# EAGLE design WMF Ambient SmartPot_B (EAGLE 9.5.1)
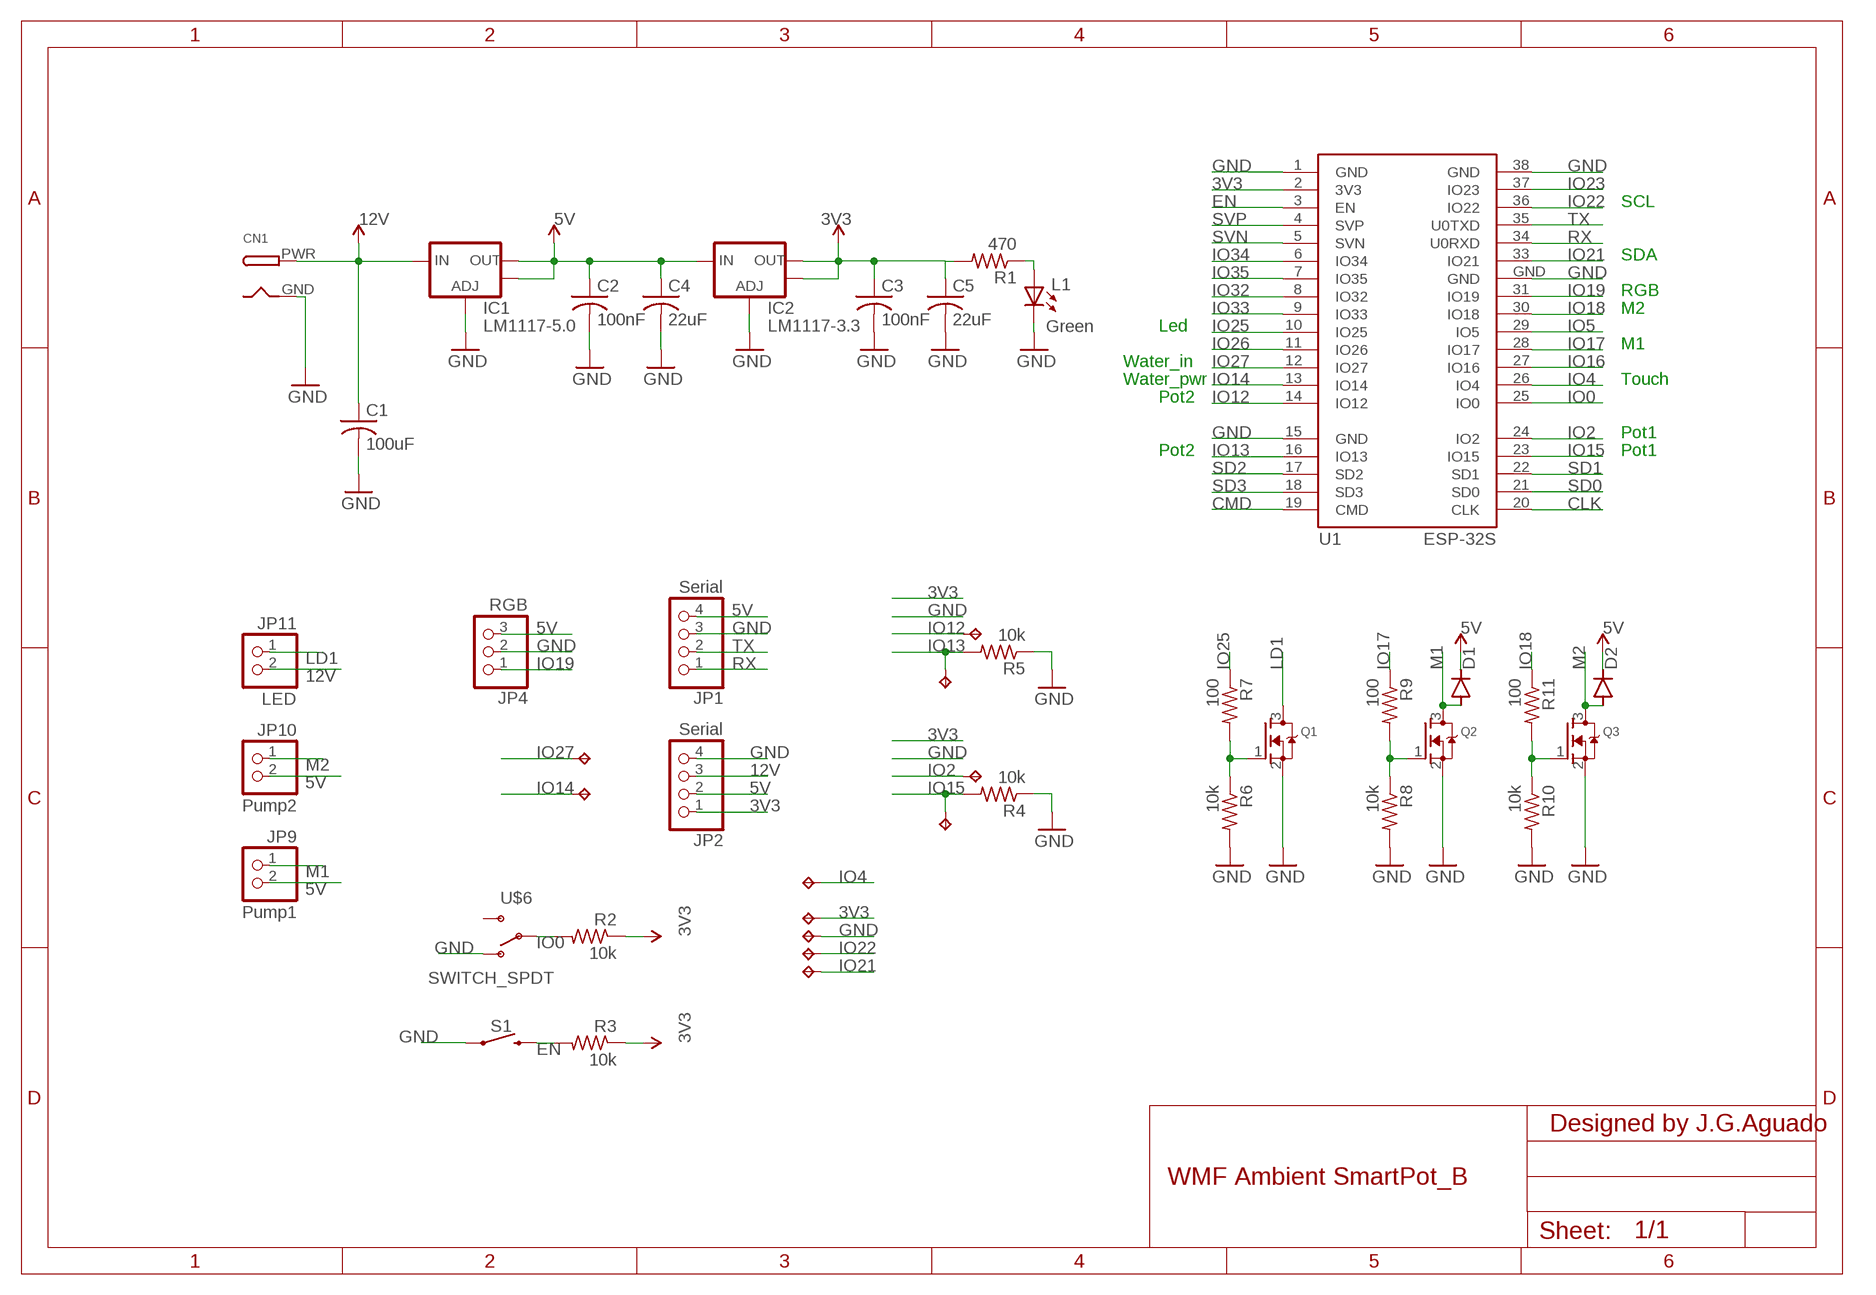
[diagram p0: schematic, sheet 1]

## Parts
C1  100uF  C1206  [1206]
C2  100nF  C1206  [1206]
C3  100nF  C1206  [1206]
C4  22uF  C1206  [1206]
C5  22uF  C1206  [1206]
CN1  DCBARREL-2  [DCJACK_2MM_PTH-2]
D1  CGRM4002-G  [SOD-123_MINI-SMA]
D2  CGRM4002-G  [SOD-123_MINI-SMA]
IC1  LM1117-5.0  V_REG_LM1117SOT223  [SOT223]
IC2  LM1117-3.3  V_REG_LM1117SOT223  [SOT223]
JP1  Serial  PINHD-1X4  [1X04]
JP2  Serial  PINHD-1X4  [1X04]
JP4  RGB  PINHD-1X3  [1X03]
JP9  Pump1  PINHD-1X2  [1X02]
JP10  Pump2  PINHD-1X2  [1X02]
JP11  LED  PINHD-1X2  [1X02]
L1  Green  LED1206  [LED1206]
Q1  MOSFET-NREFLOW  [SOT23]
Q2  MOSFET-NREFLOW  [SOT23]
Q3  MOSFET-NREFLOW  [SOT23]
R1  470  R1206  [1206]
R2  10k  R1206  [1206]
R3  10k  R1206  [1206]
R4  10k  R1206  [1206]
R5  10k  R1206  [1206]
R6  10k  R1206  [1206]
R7  100  R1206  [1206]
R8  10k  R1206  [1206]
R9  100  R1206  [1206]
R10  10k  R1206  [1206]
R11  100  R1206  [1206]
S1  MOMENTARY-SWITCH-SPST-SMD-6.0X3.5MM  [TACTILE_SWITCH_SMD_6.0X3.5MM]
TP2  TPTP15SQ  [TP15SQ]
TP3  TPTP15SQ  [TP15SQ]
TP4  TPTP15SQ  [TP15SQ]
TP5  TPTP15SQ  [TP15SQ]
TP10  TPTP15SQ  [TP15SQ]
TP11  TPTP15SQ  [TP15SQ]
TP13  TPTP15SQ  [TP15SQ]
TP14  TPTP15SQ  [TP15SQ]
TP15  TPTP15SQ  [TP15SQ]
TP18  TPTP15SQ  [TP15SQ]
TP19  TPTP15SQ  [TP15SQ]
U1  ESP-32S  [ESP-32S]
U$6  SWITCH_SPDT  [KPS-1290]

## Nets
3V3: C3.1 C5.1 IC2.2(OUT) IC2.4(OUT) JP2.1 R1.2 R2.1 R3.1 TP2.TP U1.2(3V3) ; supply symbol labelled VCC
5V: C2.1 C4.1 D1.C D2.C IC1.2(OUT) IC1.4(OUT) IC2.3(IN) JP1.4 JP2.2 JP4.3 JP9.2 JP10.2 ; supply symbol labelled VCC
12V: C1.1 CN1.PWR IC1.3(IN) JP2.3 JP11.2 ; supply symbol labelled VCC
CLK: U1.20(CLK)
CMD: U1.19(CMD)
EN: R3.2 S1.2 U1.3(EN)
GND: C1.2 C2.2 C3.2 C4.2 C5.2 CN1.GND IC1.1(ADJ) IC2.1(ADJ) JP1.3 JP2.4 JP4.2 L1.C Q1.2(S) Q2.2(S) Q3.2(S) R4.1 R5.1 R6.2 R8.2 R10.2 S1.1 TP3.TP U1.1(GND) U1.15(GND) U1.38(GND) U1.GND U$6.O
IO0: R2.2 U1.25(IO0) U$6.P
IO2: TP15.TP U1.24(IO2)
IO4: TP10.TP U1.26(IO4)
IO5: U1.29(IO5)
IO12: TP14.TP U1.14(IO12)
IO13: R5.2 TP18.TP U1.16(IO13)
IO14: TP13.TP U1.13(IO14)
IO15: R4.2 TP19.TP U1.23(IO15)
IO16: U1.27(IO16)
IO17: R9.1 U1.28(IO17)
IO18: R11.1 U1.30(IO18)
IO19: JP4.1 U1.31(IO19)
IO21: TP5.TP U1.33(IO21)
IO22: TP4.TP U1.36(IO22)
IO23: U1.37(IO23)
IO25: R7.1 U1.10(IO25)
IO26: U1.11(IO26)
IO27: TP11.TP U1.12(IO27)
IO32: U1.8(IO32)
IO33: U1.9(IO33)
IO34: U1.6(IO34)
IO35: U1.7(IO35)
LD1: JP11.1 Q1.3(D)
M1: D1.A JP9.1 Q2.3(D)
M2: D2.A JP10.1 Q3.3(D)
N$1: L1.A R1.1
N$6: Q1.1(G) R6.1 R7.2
N$7: Q2.1(G) R8.1 R9.2
N$8: Q3.1(G) R10.1 R11.2
RX: JP1.1 U1.34(U0RXD)
SD0: U1.21(SD0)
SD1: U1.22(SD1)
SD2: U1.17(SD2)
SD3: U1.18(SD3)
SVN: U1.5(SVN)
SVP: U1.4(SVP)
TX: JP1.2 U1.35(U0TXD)
Unconnected: U$6.S

## Notes on the sheet
- SCL
- SDA
- RGB
- M2
- Led
- M1
- Water_in
- Water_pwr | Touch
- Pot2
- Pot1
- Pot2 | Pot1
- Designed by J.G.Aguado

## Library data of the parts
C1-C5 = SpaceDIY_passive_components:C1206
CN1 = SpaceDIY_connectors:DCBARREL-2: 2.0mm DC Barrel Jack DCJACK_2MM_PTH - Through Hole Jack (4UConnector: 05537)
D1 D2 = diode:CGRM400*-G: Molded plasitc,JEDEC SOD-123/Mini SMA Source: Comchip CGRM4001-G.pdf
IC1 IC2 = SparkFun:V_REG_LM1117: Voltage Regulator LM1117 Standard adjustable voltage regulator but in SMD form. Spark Fun Electronics SKU : COM-00595
JP1 JP2 = SpaceDIY_connectors:PINHD-1X4: PIN HEADER
JP4 = SpaceDIY_connectors:PINHD-1X3: PIN HEADER
JP9-JP11 = SpaceDIY_connectors:PINHD-1X2: PIN HEADER
L1 = SpaceDIY_passive_components:LED1206
Q1-Q3 = adafruit:MOSFET-N: N-Channel Mosfet 2N7002E - 60V 260mA SOT23 [Digikey: 2N7002ET1GOSTR-ND] - REEL BSH103 - 30V 850mA SOT23 [Digikey: 568-5013-1-ND]
R1-R11 = SpaceDIY_passive_components:R1206
S1 = SparkFun-Switches:MOMENTARY-SWITCH-SPST: Momentary Switch (Pushbutton) - SPST Normally-open (NO) SPST momentary switches (buttons, pushbuttons). Variants PTH-12MM - 12mm square, through-hole Momentary Pushbutton Switch - 12mm Square <https://www.sparkfun.com/products/9190> (COM-09190) PTH-6.0MM, PTH-6.0MM-KIT - 6.0mm square, through-hole Mini Pushbutton Switch <https://www.sparkfun.com/products/97> (COM-00097) KIT package intended for soldering kit's - only one side of pads' copper is exposed. PTH-RIGHT-ANGLE-KIT - Right-angle, through-hole Right Angle Tactile Button <https://www.sparkfun.com/products/10791> - Used on SparkFun BigTime Watch Kit <https://www.sparkfun.com/products/11734> SMD-12MM - 12mm square, surface-mount Tactile Button - SMD (12mm) <https://www.sparkfun.com/products/12993> (COM-12993) Used on SparkFun PicoBoard <https://www.sparkfun.com/products/11888> SMD-4.5MM - 4.5mm Square Trackball Switch Used on SparkFun Blackberry Trackballer Breakout <https://www.sparkfun.com/products/13169> SMD-4.6MMX2.8MM - 4.60mm x 2.80mm, surface mount Used on SparkFun SAMD21 Mini Breakout <https://www.sparkfun.com/products/13664> SMD-5.2MM, SMD-5.2-REDUNDANT - 5.2mm square, surface-mount Mini Pushbutton Switch - SMD <https://www.sparkfun.com/products/8720> (COM-08720) Used on Arduino Pro Mini <https://www.sparkfun.com/products/11114> REDUNDANT package connects both switch circuits together SMD-6.0X3.5MM - 6.0 x 3.5mm, surface mount Momentary Reset Switch SMD <https://www.sparkfun.com/products/8229> (COM-08229) SMD-6.2MM-TALL - 6.2mm square, surface mount Tactile Button - SMD (6mm) <https://www.sparkfun.com/products/12992> Used on SparkFun Digital Sandbox <https://www.sparkfun.com/products/12651> SMD-RIGHT-ANGLE - Right-angle, surface mount Used on SparkFun Block for Intel® Edison - Arduino <https://www.sparkfun.com/products/13036>; PROD_ID: SWCH-00815; SF_SKU: COM-08229
TP2-TP5 TP10 TP11 TP13-TP15 TP18 TP19 = testpad:TP: Test pad
U1 = esp32:ESP-32S: Ai-Thinker ESP-32S
U$6 = SparkFun-Retired:SWITCH_SPDT: SWCH-10651 Side-actuated SPDT slide switch, as used on the Arduino Pro; PROD_ID: SWCH-10651

## Board
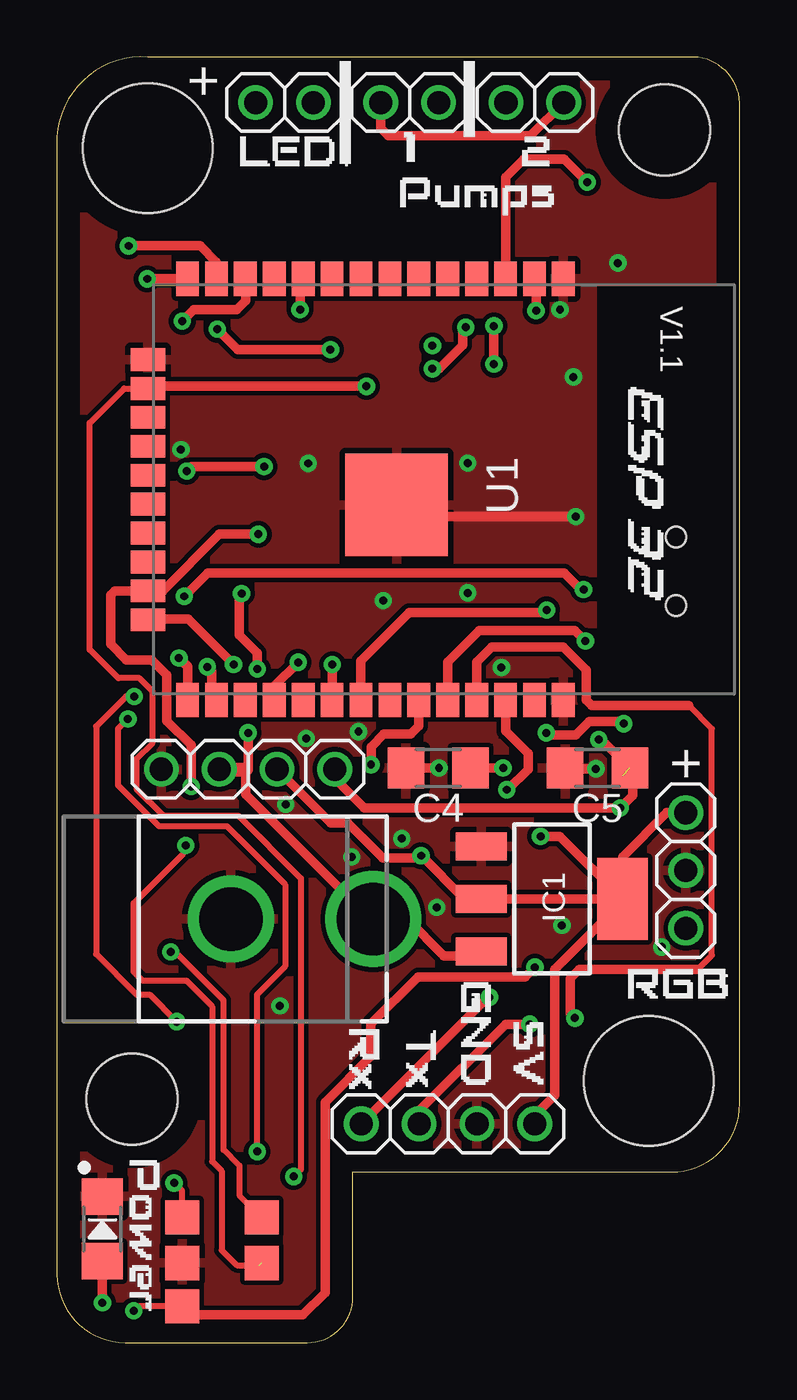
[diagram p1: board, top side]
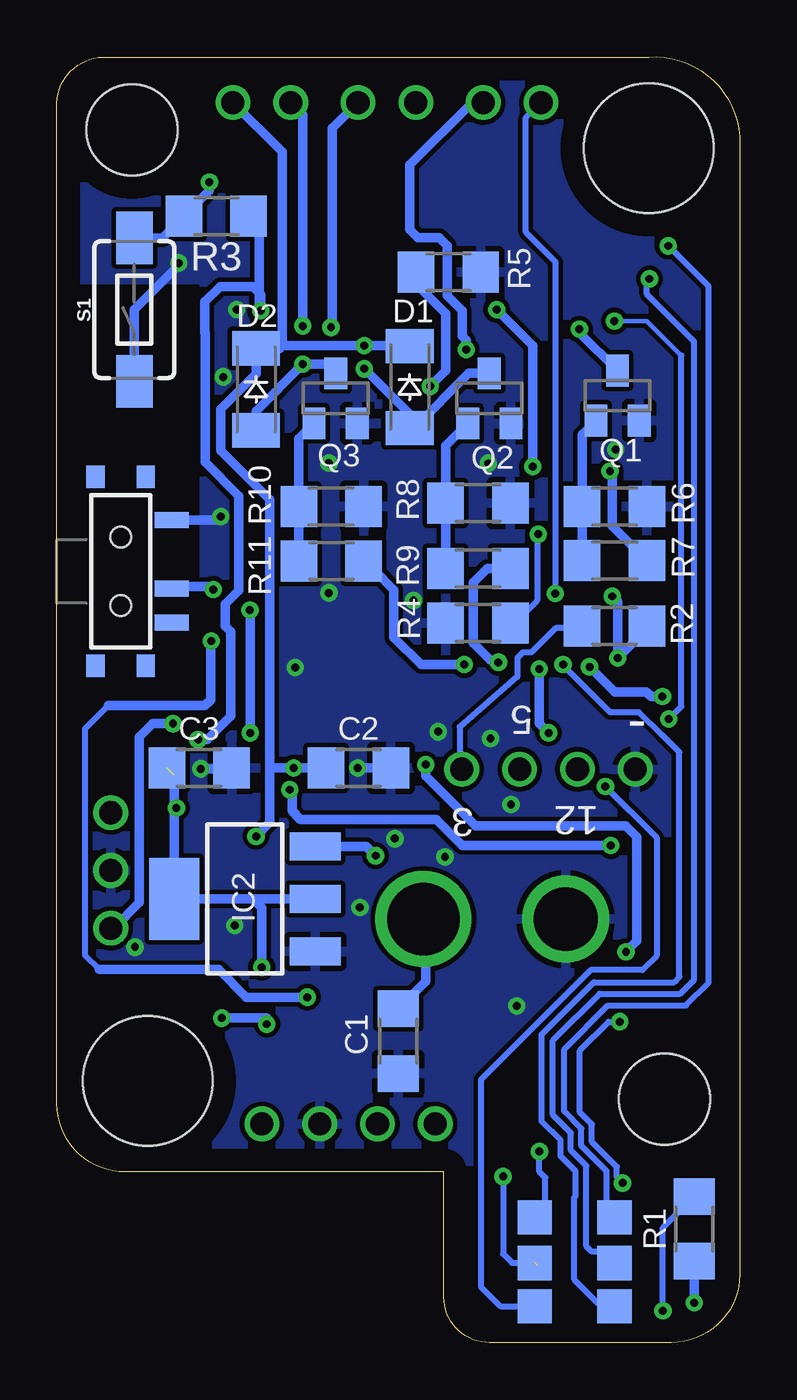
[diagram p2: board, bottom side, seen from below]

Size 30 x 56.51 mm. Coordinates in mm from the lower left corner, seen from the top.
Outline: 4,56.5 arc90 0,53 0,3 arc90 3,0 11,0 arc90 13,2 13,7.5 27,7.5 arc90 30,10.5 30,54.5 arc90 27.8,56.5 4,56.5
Copper layers (1*16): Top 0.035mm / dielectric 1.5mm / Bottom 0.035mm
Design rules "PCBway": minimum track width 6mil, minimum drill 0.3mm, track to track 0.205mm, track to pad 0.205mm, pad to pad 0.205mm, via to via 0.205mm, smd to smd 8mil, copper to edge 40mil, drill to drill 8mil, minimum pad ring 10mil, minimum via ring 8mil, stop-mask expansion 4mil, vias tented up to drill 25mil, thermal gap 10mil
Holes 5.7 mm at 4,52.5 26,11.5
Holes 4 mm at 3.3,10.7 26.7,53.3

### Footprints (pad centres in the part's own frame; a part is rotated, then mirrored left to right if it is on the bottom)
1206 = smd 1.6 x 1.803: 1 -1.422,0; 2 1.422,0
DCJACK_2MM_PTH-2 = drill 2.8: GND 0,7.35 | drill 3.2: PWR 0,13.6
SOD-123_MINI-SMA = smd 1.5 x 2.1: A 1.8,0; C -1.8,0
SOT223 = smd 1.219 x 2.235: 1 -2.311,-3.099; 2 0,-3.099; 3 2.311,-3.099 | smd 3.6 x 2.2: 4 0,3.099
1X04 = drill 1.016: 1 -3.81,0; 2 -1.27,0; 3 1.27,0; 4 3.81,0
1X03 = drill 1.016: 1 -2.54,0; 2 0,0; 3 2.54,0
1X02 = drill 1.016: 1 -1.27,0; 2 1.27,0
LED1206 = smd 1.6 x 1.803: A -1.422,0; C 1.422,0
SOT23 = smd 1 x 1.4: 1 -0.95,-1.1; 2 0.95,-1.1; 3 0,1.1
TACTILE_SWITCH_SMD_6.0X3.5MM = smd 2.3 x 1.6: 1 -3.15,0; 2 3.15,0
TP15SQ = smd 1.5 x 1.5: TP 0,0
ESP-32S = smd 1.5 x 1: 1 -9.25,7; 2 -9.25,5.73; 3 -9.25,4.46; 4 -9.25,3.19; 5 -9.25,1.92; 6 -9.25,0.65; 7 -9.25,-0.62; 8 -9.25,-1.89; 9 -9.25,-3.16; 10 -9.25,-4.43; 11 -9.25,-5.7; 12 -9.25,-6.97; 13 -9.25,-8.24; 14 -9.25,-9.51; 25 9.25,-9.51; 26 9.25,-8.24; 27 9.25,-6.97; 28 9.25,-5.7; 29 9.25,-4.43; 30 9.25,-3.16; 31 9.25,-1.89; 32 9.25,-0.62; 33 9.25,0.65; 34 9.25,1.92; 35 9.25,3.19; 36 9.25,4.46; 37 9.25,5.73; 38 9.25,7 | smd 1 x 1.5: 15 -5.7,-11.25; 16 -4.43,-11.25; 17 -3.16,-11.25; 18 -1.89,-11.25; 19 -0.62,-11.25; 20 0.65,-11.25; 21 1.92,-11.25; 22 3.19,-11.25; 23 4.46,-11.25; 24 5.73,-11.25 | smd 4.5 x 4.5: GND 0.68,-0.33
KPS-1290 = smd 0.7 x 1.5: O -2.25,2.25; P 0.75,2.25; S 2.25,2.25 | smd 1 x 0.8: P$1 -4.15,1.1; P$2 -4.15,-1.1; P$3 4.15,-1.1; P$4 4.15,1.1 | hole 0.9: -1.5,0; 1.5,0

### Placement (x,y rotation side)
C1  15,13.25 270 bottom
C2  16.75,25.25 0 bottom
C3  23.75,25.25 0 bottom
C4  16.75,25.25 180 top
C5  23.75,25.25 180 top
CN1  0.3,18.61 270 top
D1  14.5,42 270 bottom
D2  21.25,41.89 270 bottom
IC1  21.75,19.5 270 top
IC2  21.75,19.5 90 bottom
JP1  17.18,9.62 0 top
JP2  8.4,25.2 180 top
JP4  27.63,20.75 90 top
JP9  15.5,54.5 180 top
JP10  21,54.5 0 top
JP11  10,54.5 180 top
L1  2,5 90 top
Q1  5.37,41.62 0 bottom
Q2  11,41.5 0 bottom
Q3  17.75,41.5 0 bottom
R1  2,5 90 bottom
R2  5.5,31.5 0 bottom
R3  23,49.5 180 bottom
R4  11.5,31.62 0 bottom
R5  12.8,47.05 180 bottom
R6  5.5,36.75 0 bottom
R7  5.5,34.37 180 bottom
R8  11.5,36.9 0 bottom
R9  11.5,34.01 180 bottom
R10  17.95,36.75 0 bottom
R11  17.95,34.35 180 bottom
S1  26.6,45.4 90 bottom
TP2  5.5,1.6 90 top
TP3  5.5,3.5 90 top
TP4  9,3.5 90 top
TP5  9,5.5 90 top
TP10  5.5,5.5 90 top
TP11  9,5.5 0 bottom
TP13  5.5,5.5 0 bottom
TP14  5.5,3.5 0 bottom
TP15  5.5,1.6 0 bottom
TP18  9,3.5 0 bottom
TP19  9,1.6 0 bottom
U1  15.25,37.5 270 top
U$6  27.2,33.9 270 bottom

### Tracks (layer width: path | path; a pad name or v marks a point on that pad's centre or on a via)
3V3  (via drill 0.35)  (2 unrouted)
  Top 0.254: TP2.TP 5.3,1.6 3.58,1.6 v3.38,1.39 | 21.2,47.08 21.05,46.93
  Top 0.406: TP2.TP 5.9,2 | v21,16.5 20.58,16.08 15.88,16.08 13.8,14 13.8,12.58 11.78,10.56 11.78,2.2 10.8,1.22 5.68,1.22 5.3,1.6 | U1.2 20.98,47 21.05,46.93 v21.05,45.35 | JP2.1 12.21,24.79 13.5,23.5 v24.75,23.5 25.29,24.04 25.29,25.13 C5.1 23.92,26.5 v23.8,26.5
  Bottom 0.254: v3.38,1.39 3.38,5.05 R1.2 | 7.02,31.4 8.09,31.4 9.16,30.33 9.53,30.33 9.77,30.1 9.77,29.27 12.31,27.06 12.31,25.3 JP2.1 | R3.1 21.2,49.88
  Bottom 0.406: IC2.2 21.4,19.5 | 21.4,19.5 IC2.4 24.85,24.93 | v21,16.5 21,19.1 21.4,19.5 | v23.8,26.5 23.4,26.5 22.35,27.55 22.35,31.25 22.6,31.5 22.6,32.45 22,33.06 22,37.2 23.49,38.69 23.49,44.37 23.5,44.38 23.5,45.75 22.83,46.42 21.41,46.42 21.05,46.06 v21.05,45.35 21.1,45.4 | R2.1 7.02,31.4 | 21,45.5 21.1,45.4 | R3.1 21.1,49.02 21.1,45.4
5V  (via drill 0.35)
  Top 0.406: IC1.4 IC1.2 17.9,19.5 v16,21.4 15.9,21.3 14.31,21.3 12.78,22.84 12.03,22.84 JP2.2 | IC1.4 24.85,21.35 26.79,23.29 JP4.3 | IC1.4 22.1,22.25 v21.25,22.25 | IC1.4 24.85,19.38 21.87,16.4 21.87,10.87 20.99,9.99 JP1.4 | JP9.2 14.23,53.37 14.56,53.04 20.81,53.04 JP10.2 | C4.1 v19.6,25.25
  Bottom 0.406: v21.25,22.25 20.65,22.85 20.65,25.25 | 20.65,25.25 v19.6,25.25 C4.1 | D1.C 14.51,43.81 v16.5,43.81 20.1,43.81 | 20.1,43.81 20.2,43.81 20.2,43.69 D2.C 21.25,42.58 22.8,41.03 22.8,39.2 20.65,37.05 20.65,25.25 | JP10.2 20.1,52.33 20.1,43.81 | v16,21.4 16.41,21.81 IC2.3
12V  (via drill 0.35)
  Top 0.406: IC1.3 18.46,17 17,17 15.39,18.61 CN1.PWR 13.78,18.61 8.3,24.09 8.3,25.2 8.4,25.3 v8.4,26.8 | v8.81,29.6 8.81,30.3 8.01,31.1 8.01,32.73 v8.11,32.93
  Top 0.61: JP2.3 8.3,25.2
  Bottom 0.254: JP11.2 9.4,53.83 9.4,48.8 8.1,47.5 v8.11,32.93
  Bottom 0.406: C1.1 13.79,15.88 13.79,18.6 13.9,18.71 CN1.PWR | v8.81,29.6 8.81,27.21 v8.4,26.8
EN  (via drill 0.35)
  Top 0.406: v23.3,51 22.3,52 20.5,52 19.71,51.21 U1.3
  Bottom 0.406: S1.2 25.37,48.55 R3.2 23.3,50.62 v23.3,51
GND  (via drill 0.35)
  Top 0.406: v22.8,36.3 15.44,36.3 U1.GND | C4.2 v16.79,25.25 | v23.68,25.22 22.36,25.22 C5.2
  Bottom 0.406: U$6.O 22.95,36.15 v22.8,36.3 | C4.2 v16.79,25.25 16.7,25.16 16.7,25.1 | S1.1 26.6,45.4 24.6,47.4 v24.65,47.45 | v23.68,25.22 22.36,25.22 C5.2
  other vias: 14.33,32.61 18.05,32.95 11.05,38.64 18.05,38.65 5.45,39.25 13.25,26.85 10.95,26.55 12.95,21.35 26.57,17.38 19.53,29.67 22.19,18.33 22.69,42.44 22.1,45.4 9.8,14.8 15.15,22.15 16.69,19.13 10.05,23.65
  pour Top: 0.3,56.5 30,56.5 30,7.5 13.28,7.5 13.26,0.04 0.3,-0.04
  pour Bottom: 0.3,0 13.25,0 13.25,7.5 30,7.5 30,56.5 0.3,56.5
IO0  (via drill 0.35)
  Top 0.406: v5.36,30.09 5.74,29.71 U1.25 | v23.14,33.1 23.02,33.1 22.3,33.82 6.62,33.82 v5.6,32.8
  Bottom 0.406: R2.2 4.08,31.38 v5.36,30.09 5.36,32.56 v5.6,32.8 | U$6.P 24.88,33.22 23.26,33.22 v23.14,33.1
IO2  (via drill 0.35)
  Top 0.406: U1.24 4.03,31.8 5.76,31.8 v7.76,29.8
  Bottom 0.254: 5.65,1.75 6.25,1.75 7.26,2.76 7.26,6.4 7.23,6.44 7.23,7.55 7.87,8.2 7.87,8.91 8.7,9.73 8.7,13.55 6.41,15.84 2.88,15.84 2.65,16.07 2.65,25.95 3.4,26.7 3.41,26.7 4.42,27.7 5.7,27.7 7.76,29.76 v7.76,29.8
  Bottom 0.406: TP15.TP 5.65,1.75
IO4  (via drill 0.35)
  Top 0.254: TP10.TP 5.5,6.66 v5.15,7.01 | v5.27,14.1 4.08,15.3 3.49,15.3 1.72,17.08 1.72,27.08 3.04,28.4 v3.4,28.4
  Top 0.406: v6.6,29.7 6.8,29.5 6.8,28.46 U1.26
  Bottom 0.254: v5.15,7.01 5.4,7.26 5.4,7.73 6.5,8.83 6.5,9.59 7.03,10.13 7.03,12.83 5.76,14.1 v5.27,14.1
  Bottom 0.406: v3.4,28.4 3.9,28.4 4.1,28.6 5.5,28.6 v6.6,29.7
IO12  (via drill 0.35)
  Top 0.406: U1.14 v3.97,46.75
  Bottom 0.254: 6,4 6.5,4 6.74,4.24 6.74,7.77 7.41,8.45 7.41,9.22 8.21,10.01 8.21,13.27 6.16,15.33 2.62,15.33 2,15.95 2,44 4.09,46.09 4.09,46.75
  Bottom 0.406: TP14.TP 6,4 | 4.09,46.75 v3.97,46.75
IO13  (via drill 0.35)
  Top 0.254: U1.16 2.96,41.93 1.44,40.41 1.44,30.46 2.7,29.2 3.62,29.2 4.2,28.62 4.2,26.36 3.5,25.65 3.5,24.34 4.67,23.16 7.96,23.16 10.71,20.41 10.71,7.62 v10.4,7.3
  Top 0.406: v13.6,42.03 4.1,42.03 U1.16
  Bottom 0.254: v10.4,7.3 10.4,3.9 10,3.5 TP18.TP
  Bottom 0.406: v13.6,42.03 12.92,42.71 12.92,45.22 14.75,47.05 R5.2
IO14  (via drill 0.35)
  Top 0.406: U1.13 7.01,47.49 6.3,48.2 v3.15,48.2
  Bottom 0.254: TP13.TP 5.86,5.86 5.86,7.54 6.96,8.64 6.96,9.41 7.71,10.16 7.71,12.9 5.79,14.81 2.37,14.81 1.37,15.81 1.37,46.42 v3.15,48.2
IO15  (via drill 0.35)
  Top 0.406: v8.85,35.53 7.13,35.53 4.64,33.04 U1.23 2.54,33.04 2.36,32.86 2.36,30.69 3.05,30 4.17,30 4.83,29.33 4.83,27.33 5.9,26.26 v5.9,24.44
  Bottom 0.254: 8.78,35.43 8.9,35.31 8.9,32.62 9.9,31.62 | TP19.TP 10.52,1.6 11.38,2.46 11.38,11.55 6.55,16.37 4.28,16.37 3.66,17 3.66,22.2 v5.9,24.44
  Bottom 0.406: v8.85,35.53 8.78,35.46 8.78,35.43 | 9.9,31.62 R4.2
IO17  (via drill 0.35)
  Top 0.406: U1.28 9.55,28.85 v10.6,29.9
  Bottom 0.406: v10.6,29.9 10.7,30 10.96,30 11.7,30.74 11.7,33.4 11.09,34.01 R9.1
IO18  (via drill 0.35)
  Top 0.406: v12.1,29.8 U1.30
  Bottom 0.406: R11.1 16.08,33.9 16.01,33.9 15.19,33.08 15.19,30.99 14,29.8 v12.1,29.8
IO19  (via drill 0.35)
  Top 0.406: v24.9,27.2 24.8,27.3 23.4,27.3 22.8,26.7 21.5,26.7 v21.5,26.8 | v21.52,32.2 21.52,32.08 15.48,32.08 13.36,29.96 U1.31
  Bottom 0.406: JP4.1 27.51,18.21 26.38,19.34 26.38,26.62 25.8,27.2 v24.9,27.2 | v21.52,32.2 21.5,32.18 v21.5,26.8
IO21  (via drill 0.35)
  Top 0.254: TP5.TP 8.02,6.48 8.02,7.78 7.32,8.47 7.32,15.04 5.19,17.17 v5,17.17
  Top 0.406: v13.8,25.4 13.8,26.18 14.37,26.75 15.55,26.75 15.9,27.1 U1.33
  Bottom 0.406: v5,17.17 4.52,17.65 4.52,22.23 5,22.7 11.6,22.7 13.8,24.9 v13.8,25.4
IO22  (via drill 0.35)  (1 unrouted)
  Top 0.254: v5.66,21.84 5.54,21.84 5.54,21.48 3.37,19.3 3.37,16.3 3.77,15.9 5.69,15.9 6.82,14.77 6.82,7.96 7.23,7.55 7.23,4.07 7.9,3.4 8.9,3.4
  Top 0.406: v19.77,24.3 19.71,24.36 19.8,24.3 20.7,25.2 20.7,25.9 19.71,26.89 U1.36
  Bottom 0.406: v5.66,21.84 12.18,21.84 13.34,23 19.3,23 19.67,23.37 19.67,24.2 v19.77,24.3
IO25  (via drill 0.35)
  Top 0.406: v5.7,38.3 5.9,38.5 v9.1,38.5 | v10.68,45.4 10.68,46.61 U1.10
  Bottom 0.406: R7.1 5.6,35.89 5.6,38.3 v5.7,38.3 | v9.1,38.5 9.1,43.82 v10.68,45.4
IO27  (via drill 0.35)
  Top 0.254: v3.12,27.41 2.68,26.97 2.68,24.5 4.48,22.7 7.45,22.7 10.02,20.13 10.02,16.52 8.8,15.3 v8.8,8.4
  Top 0.406: U1.12 8.3,46.73 8.3,45.8 7.9,45.4 6.01,45.4 v5.51,44.89
  Bottom 0.203: 2.57,43.38 4.08,44.89 v5.51,44.89
  Bottom 0.254: TP11.TP 8.54,5.96 8.54,7.25 8.8,7.51 v8.8,8.4 | 2.57,43.38 2.57,27.96 v3.12,27.41
LD1  (via drill 0.35)
  Top 0.406: v7.05,44.54 7.94,43.65 v12.02,43.65
  Bottom 0.406: v7.05,44.54 7.05,44.39 Q1.3 | JP11.1 11.76,54.5 14.5,51.76 14.5,48.92 14.15,48.56 13.2,48.56 12.85,48.21 12.85,46.01 12.19,45.35 12.19,44.24 12.02,44.06 v12.02,43.65
M1  (via drill 0.35)
  Top 0.406: v17.96,44.62 17.84,44.5 17.84,43.84 16.8,42.8 v16.5,42.8
  Bottom 0.406: JP9.1 17.9,53.37 17.9,44.68 v17.96,44.62 | v16.5,42.8 14.5,40.8 D1.A 14.3,40.2 11.9,42.6 Q2.3
M2  (via drill 0.35)
  Top 0.406: v19.2,43 v19.2,44.68
  Bottom 0.406: Q3.3 18.15,43 v19.2,43 21.25,40.95 D2.A | v19.2,44.68 19.2,53.97 JP10.1
N$1  (via drill 0.35)
  Top 0.406: L1.A v2,1.75
  Bottom 0.406: v2,1.75 L1.A
N$6
  Bottom 0.406: Q1.1 6.92,39.92 R6.1 R7.2
N$7
  Bottom 0.406: Q2.1 12.92,39.43 R8.1 R9.2
N$8
  Bottom 0.406: Q3.1 19.37,39.73 R10.1 R11.2
RX  (via drill 0.35)
  Top 0.406: U1.34 17.17,29.92 18.55,31.3 22.75,31.3 v23.22,30.83 | v19,15.18 18.94,15.18 JP1.1
  Bottom 0.254: 27.75,28 28.78,26.97 28.78,17.03 28.15,16.4
  Bottom 0.406: v23.22,30.83 23.25,30.8 23.25,28.25 23.5,28 27.75,28 | 28.15,16.4 22.9,16.4 21.68,15.18 v19,15.18
TX  (via drill 0.35)
  Top 0.254: 28.15,16.4 28.78,17.03 28.78,26.97 27.75,28
  Top 0.406: 27.75,28 23.5,28 23.25,28.25 23.25,29.56 22.24,30.57 19.09,30.57 18.44,29.91 U1.35 | 28.15,16.4 22.95,16.4 22.56,16 22.56,14.47 v22.76,14.26 | v20.78,14 19.71,14 15.91,10.2 JP1.2
  Bottom 0.406: v22.76,14.26 20.78,14.26 v20.78,14

### Text on the board
tPlace: + | V1.1 | +
bPlace: - | 5 | 12 | 3